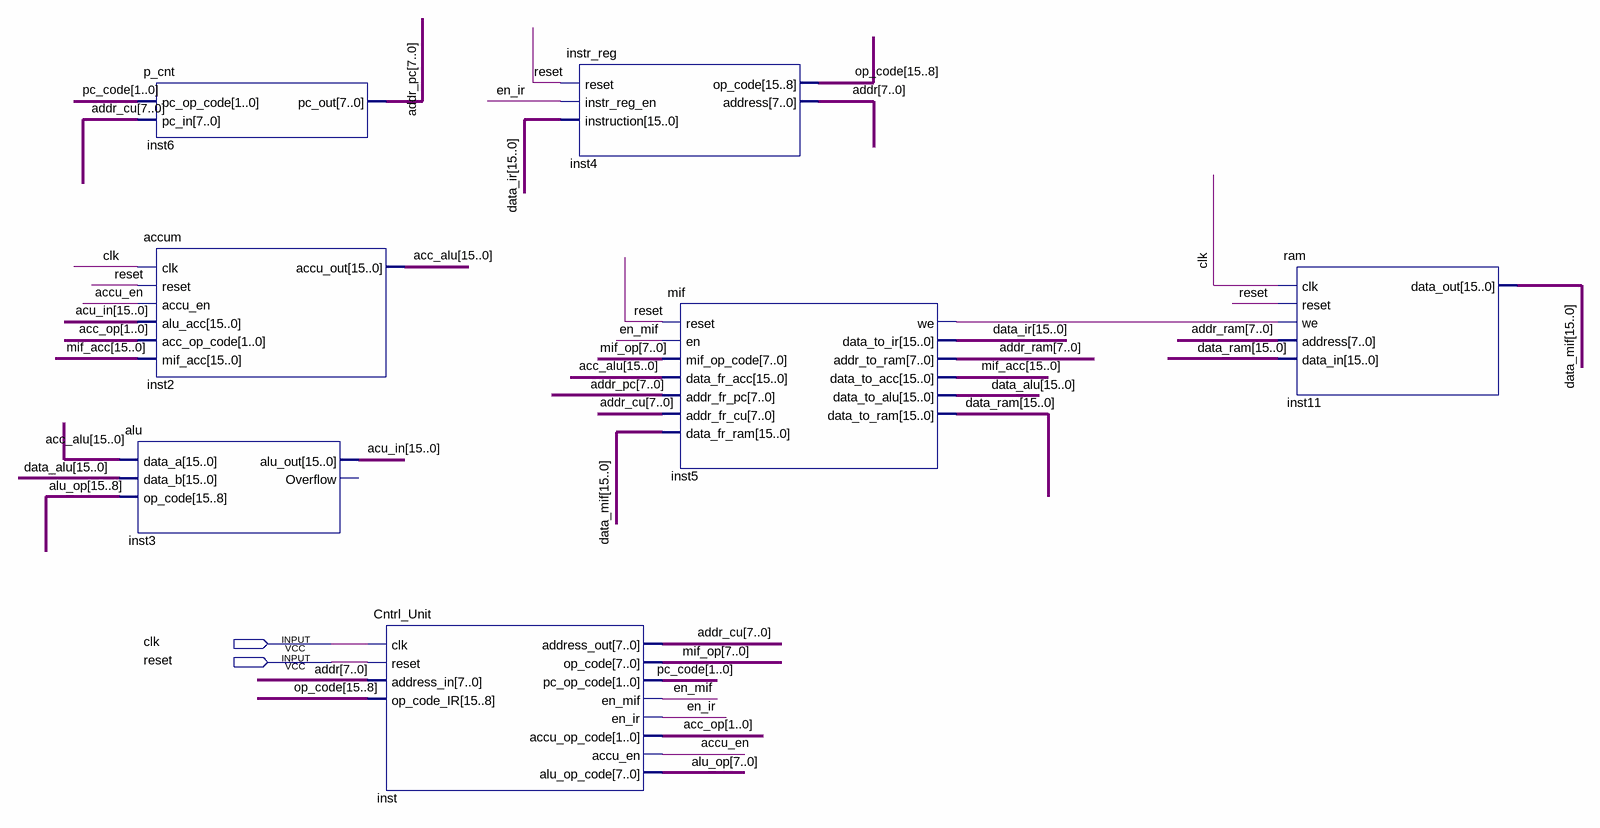
[diagram p0: schematic sheet]
// Quartus schematic 16_bit.bdf as structural Verilog: 7 symbols, 2 pins
module \16_bit  (
  input  clk,
  input  reset
);

  wire accu_en, en_ir, en_mif, inst5_we;
  wire [1:0] acc_op, pc_code;
  wire [7:0] addr, addr_cu, addr_pc, addr_ram, mif_op;
  wire [15:0] acc_alu, acu_in, alu_op, data_alu, data_ir, data_mif, data_ram, mif_acc;
  wire [15:8] op_code;

  p_cnt inst6 (.pc_op_code(pc_code), .pc_in(addr_cu), .pc_out(addr_pc));
  accum inst2 (
    .clk(clk), .reset(reset), .accu_en(accu_en), .alu_acc(acu_in), .acc_op_code(acc_op), .mif_acc(mif_acc),
    .accu_out(acc_alu));
  alu inst3 (.data_a(acc_alu), .data_b(data_alu), .op_code(alu_op[15:8]), .alu_out(acu_in));  // open: Overflow
  Cntrl_Unit inst (
    .clk(clk), .reset(reset), .address_in(addr), .op_code_IR(op_code), .address_out(addr_cu),
    .op_code(mif_op), .pc_op_code(pc_code), .en_mif(en_mif), .en_ir(en_ir), .accu_op_code(acc_op),
    .accu_en(accu_en), .alu_op_code(alu_op[7:0]));
  instr_reg inst4 (.reset(reset), .instr_reg_en(en_ir), .instruction(data_ir), .op_code(op_code), .address(addr));
  mif inst5 (
    .reset(reset), .en(en_mif), .mif_op_code(mif_op), .data_fr_acc(acc_alu), .addr_fr_pc(addr_pc),
    .addr_fr_cu(addr_cu), .data_fr_ram(data_mif), .we(inst5_we), .data_to_ir(data_ir),
    .addr_to_ram(addr_ram), .data_to_acc(mif_acc), .data_to_alu(data_alu), .data_to_ram(data_ram));
  ram inst11 (.clk(clk), .reset(reset), .we(inst5_we), .address(addr_ram), .data_in(data_ram), .data_out(data_mif));
endmodule
